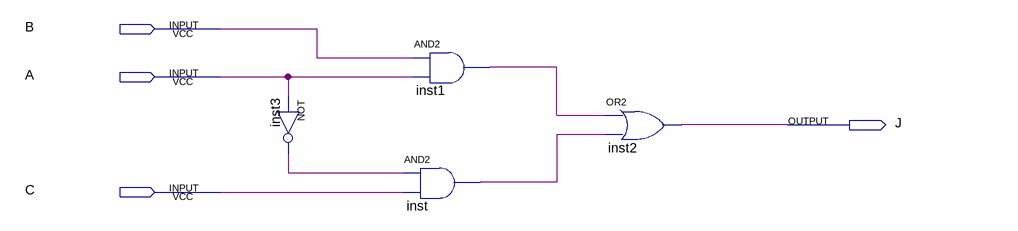
[diagram p0: schematic sheet]
// Quartus schematic circuit_J.bdf as structural Verilog: 4 symbols, 4 pins
module circuit_J (
  input  B,
  input  A,
  input  C,
  output J
);

  wire inst1_out, inst3_out, inst_out;

  not inst3 (inst3_out, A);
  and inst1 (inst1_out, B, A);
  and inst (inst_out, inst3_out, C);
  or inst2 (J, inst1_out, inst_out);
endmodule
